# EAGLE schematic power supply sch_ (EAGLE 9.7.0)
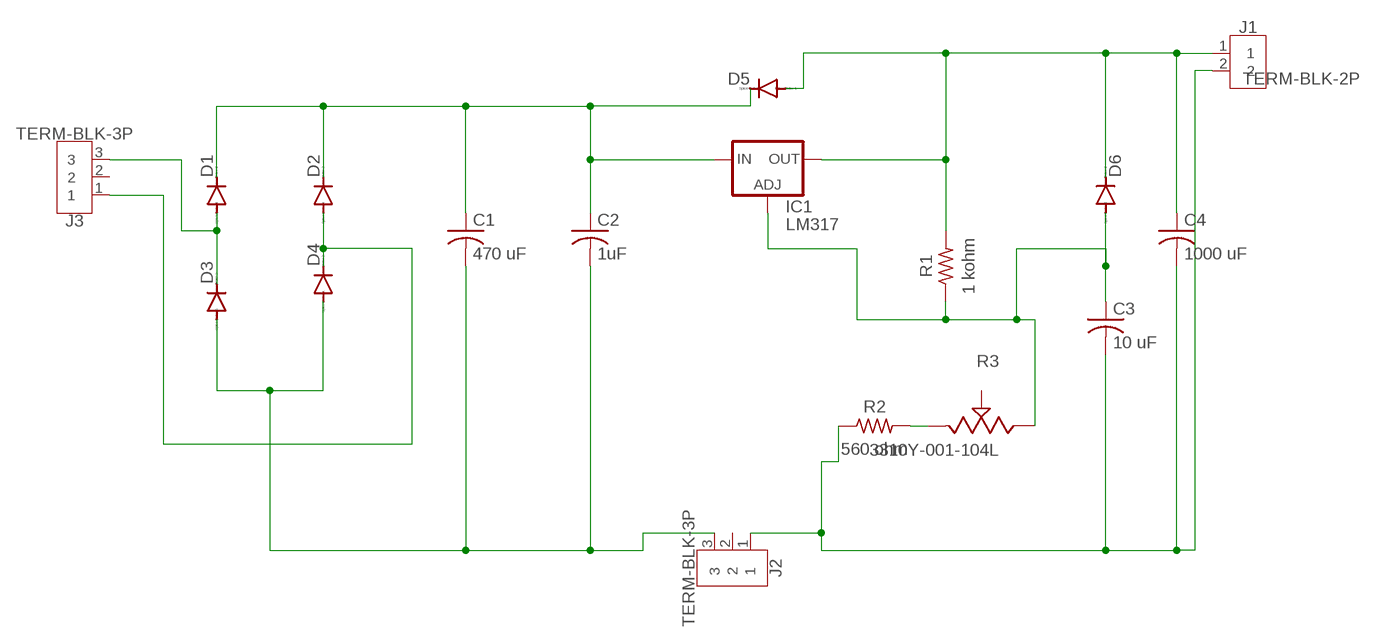
[diagram p0: schematic, sheet 1]

## Parts
C1  470 uF  C-US_RADIAL-12.5MM-DIA  [CAPRD550W60D1025H1250B]
C2  1uF  C-US_RADIAL-12.5MM-DIA  [CAPRD550W60D1025H1250B]
C3  10 uF  C-US_RADIAL-12.5MM-DIA  [CAPRD550W60D1025H1250B]
C4  1000 uF  C-US_RADIAL-12.5MM-DIA  [CAPRD550W60D1025H1250B]
D1  1N4004  [DO41-10]
D2  1N4004  [DO41-10]
D3  1N4004  [DO41-10]
D4  1N4004  [DO41-10]
D5  1N4004  [DO41-10]
D6  1N4004  [DO41-10]
IC1  LM317  LM317TL  [317TL]
J1  TERM-BLK-2P  2828XX-2282837-2  [TERMBLK_508-2N]
J2  TERM-BLK-3P  2828XX-3282837-3  [TERMBLK_508-3N]
J3  TERM-BLK-3P  2828XX-3282837-3  [TERMBLK_508-3N]
R1  1 kohm  R-US_AXIAL-7.2MM-PITCH  [RESAD724W46L381D178B]
R2  560 ohm  R-US_AXIAL-7.2MM-PITCH  [RESAD724W46L381D178B]
R3  3310Y-001-104L  [3310Y-001-104L-ND]

## Nets
N$1: D1.A D3.C J3.3
N$2: C1.1 C2.1 D1.C D2.C D5.C IC1.3(IN)
N$3: C1.2 C2.2 D3.A D4.A J2.3
N$4: D2.A D4.C J3.1
N$5: C3.2 C4.2 J1.2 J2.1 R2.1
N$6: R2.2 R3.1
N$7: C4.1 D5.A D6.C IC1.2(OUT) J1.1 R1.2
N$8: C3.1 D6.A IC1.1(ADJ) R1.1 R3.3
Unconnected: J2.2 J3.2 R3.2

## Library data of the parts
C1-C4 = Capacitor:C-US: Capacitor - ANSI; CATEGORY: Capacitor
D1-D6 = diode:1N4004: DIODE general purpose rectifier, 1 A
IC1 = v-reg:LM317TL: VOLTAGE REGULATOR
J1 = Connector:2828XX-2: 2 Position Wire to Board Terminal Block Horizontal with Board Datasheet <https://www.te.com.cn/commerce/DocumentDelivery/DDEController?Action=showdoc&DocId=Catalog+Section%7F1308389_EUROSTYLE_TERMINAL_BLOCKS%7F0607%7Fpdf%7FEnglish%7FENG_CS_1308389_EUROSTYLE_TERMINAL_BLOCKS_0607.pdf%7F2-282837-5>; CATEGORY: Fixed Terminal Blocks; DESCRIPTION: Fixed Terminal Blocks 5.08MM PCB MOUNT 2P; MANUFACTURER: TE Connectivity AMP Connectors; MPN: 282837-2; OPERATING_TEMPERATURE: -40°C to +105°C; PART_STATUS: ACTIVE; PITCH: 0.200" (5.08mm); ROHS_COMPLIANCE: RoHS Compliant; SERIES: Buchanan; SUBCATEGORY: Terminal Blocks; TYPE: Through Hole; Screw - Rising Cage Clamp; Side wire entry, Horizontal with Board
J2 J3 = Connector:2828XX-3: 3 Position Wire to Board Terminal Block Horizontal with Board Datasheet <https://www.te.com.cn/commerce/DocumentDelivery/DDEController?Action=showdoc&DocId=Catalog+Section%7F1308389_EUROSTYLE_TERMINAL_BLOCKS%7F0607%7Fpdf%7FEnglish%7FENG_CS_1308389_EUROSTYLE_TERMINAL_BLOCKS_0607.pdf%7F2-282837-5>; CATEGORY: Connector; DESCRIPTION: TERM BLK 3P SIDE ENT 5.08mm PCB; MANUFACTURER: TE Connectivity; MPN: 282837-3; OPERATING_TEMPERATURE: -40°C to +105°C; PART_STATUS: Active; PITCH: 0.200" (5.08mm); ROHS_COMPLIANCE: RoHS Compliant; SERIES: Buchanan; SUBCATEGORY: Terminal Block; TYPE: Side Wire Entry
R1 R2 = Resistor:R-US: Resistor Fixed - ANSI; CATEGORY: Resistor; SUB-CATEGORY: Fixed
R3 = Potentiometer_Trimmers:3310Y-001-104L: POT 100K OHM 1/4W PLASTIC LINEAR Manufacturer's datasheet <https://www.bourns.com/docs/Product-Datasheets/3310.pdf>; CREATED_BY: PCBLayout.com; DIGIKEY_PARTNO: 3310Y-001-104L-ND; MANUFACTURER: Bourns Inc.; MPN: 3310Y-001-104L